# Altium schematic sheet auxpreamp_riaa.SchDoc
size A4; SheetNumber: 1; SheetTotal: 1
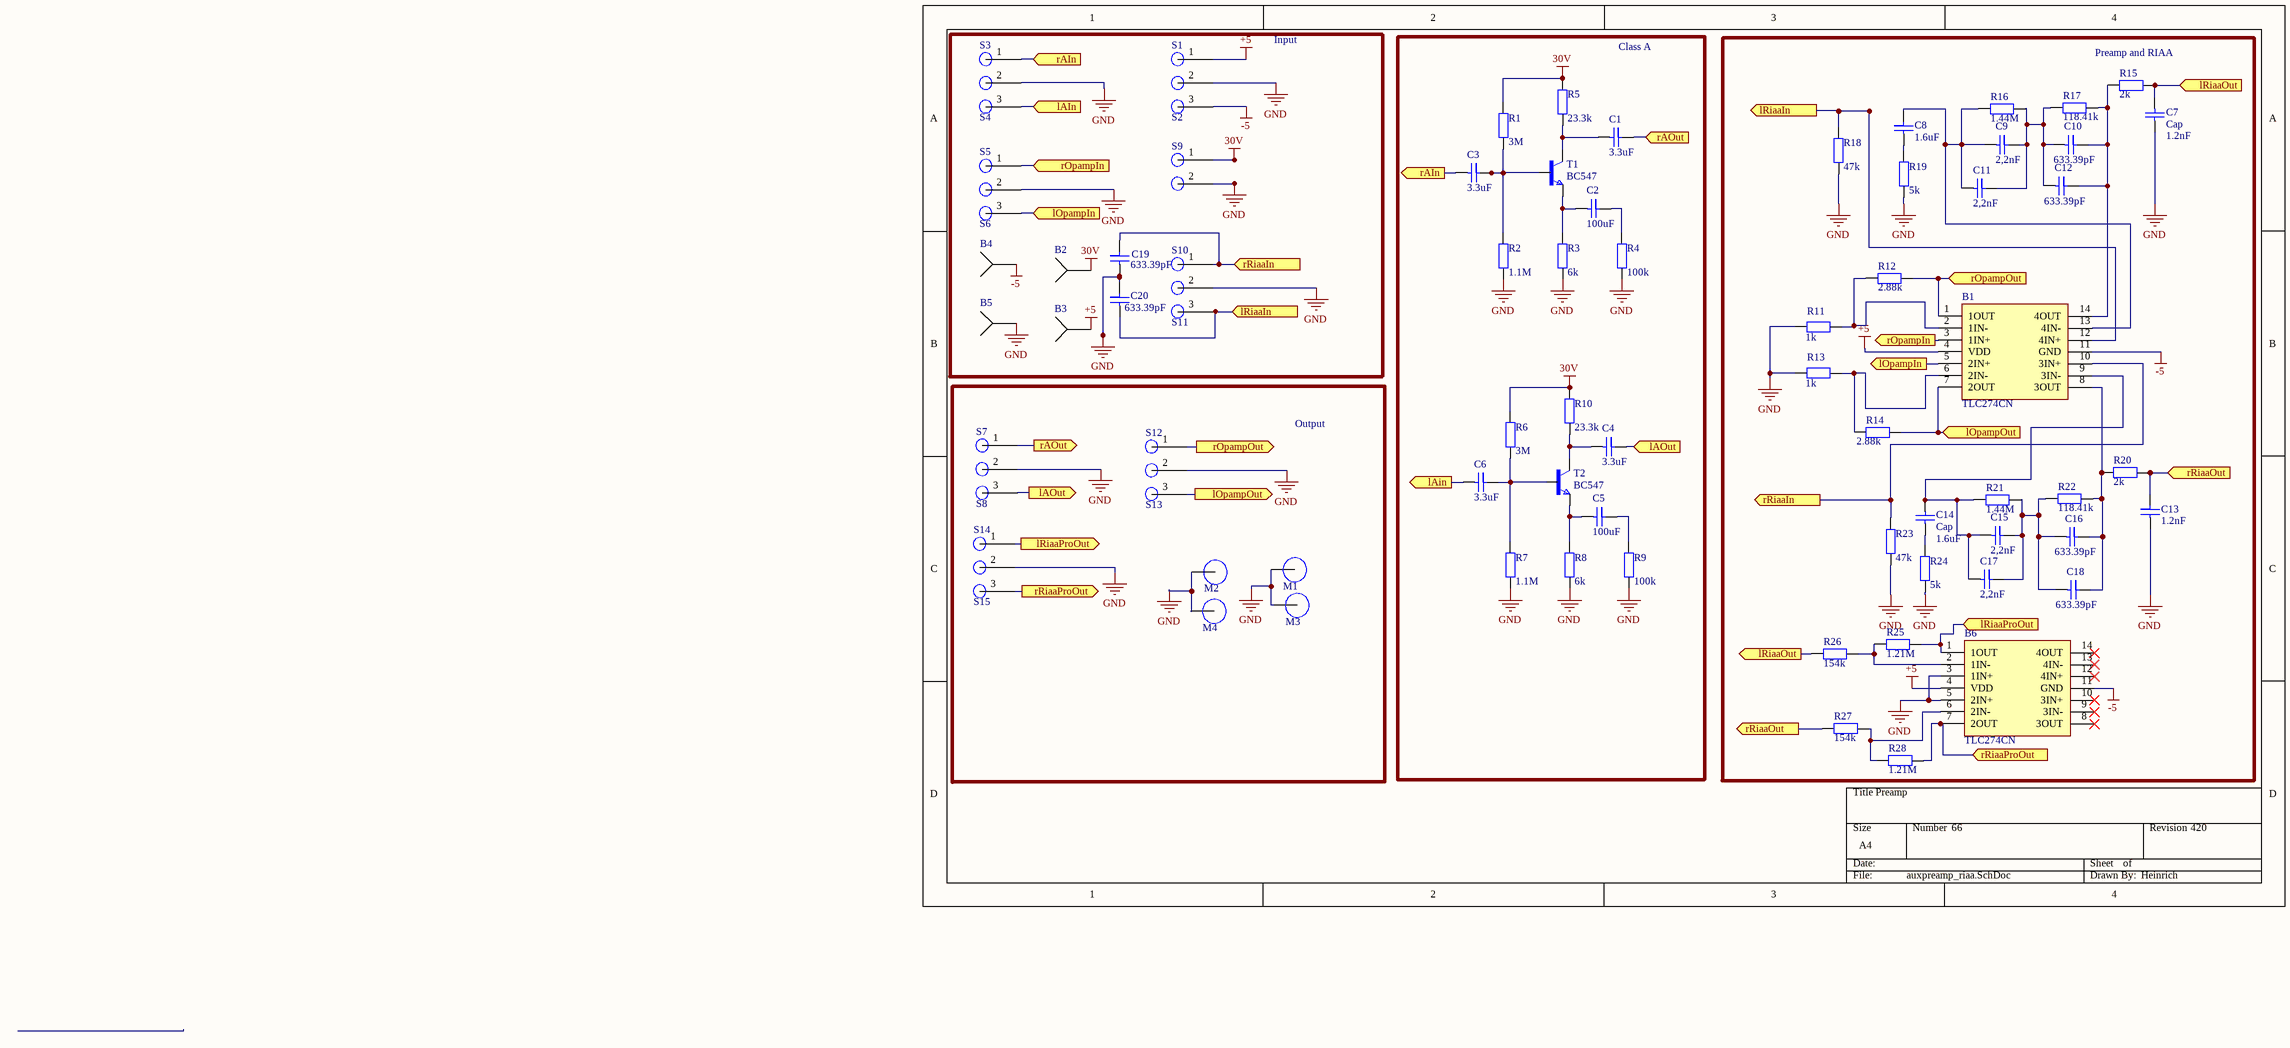
[diagram p0: auxpreamp_riaa.SchDoc]

## Parts
B1  TLC274CN  [DIP794W53P254L1930H508Q14N]
B2  Banana Plug  [Banana Plug On top]  (value not drawn)
B3  Banana Plug  [Banana Plug On top]  (value not drawn)
B4  Banana Plug  [Banana Plug On top]  (value not drawn)
B5  Banana Plug  [Banana Plug On top]  (value not drawn)
B6  TLC274CN  [DIP794W53P254L1930H508Q14N]
C1  Capacity: 3.3uF  [Cap 20mm]  (hidden comment: Cap)
C2  Capacity: 100uF  [Cap Ø8]  (hidden comment: Cap)
C3  Capacity: 3.3uF  [Cap 20mm]  (hidden comment: Cap)
C4  Capacity: 3.3uF  [Cap 20mm]  (hidden comment: Cap)
C5  Capacity: 100uF  [Cap Ø8]  (hidden comment: Cap)
C6  Capacity: 3.3uF  [Cap 20mm]  (hidden comment: Cap)
C7  Cap  value 1.2nF  [RAD-0.3  PCBK]
C8  Capacity: 1.6uF  [Cap-1]  (hidden comment: Cap)
C9  Capacity: 2,2nF  [Cap-1]  (hidden comment: Cap)
C10  Capacity: 633.39pF  [Cap-0]  (hidden comment: Cap)
C11  Capacity: 2,2nF  [Cap-1]  (hidden comment: Cap)
C12  Capacity: 633.39pF  [Cap-0]  (hidden comment: Cap)
C13  Capacity: 1.2nF  [Cap-0]  (hidden comment: Cap)
C14  Cap  value 1.6uF  [RAD-0.3  PCBK]
C15  Capacity: 2,2nF  [Cap-1]  (hidden comment: Cap)
C16  Capacity: 633.39pF  [Cap-0]  (hidden comment: Cap)
C17  Capacity: 2,2nF  [Cap-1]  (hidden comment: Cap)
C18  Capacity: 633.39pF  [Cap-0]  (hidden comment: Cap)
C19  Capacity: 633.39pF  [Cap-0]  (hidden comment: Cap)
C20  Capacity: 633.39pF  [Cap-0]  (hidden comment: Cap)
M1  Screw Hole  [M3 Hole]  (value not drawn)
M2  Screw Hole  [M3 Hole]  (value not drawn)
M3  Screw Hole  [M3 Hole]  (value not drawn)
M4  Screw Hole  [M3 Hole]  (value not drawn)
R1  value 3M  [AXIAL-0.4 PCBK]  (hidden comment: R1)
R2  value 1.1M  [AXIAL-0.4 PCBK]  (hidden comment: R2)
R3  value 6k  [AXIAL-0.4 PCBK]  (hidden comment: R3)
R4  value 100k  [AXIAL-0.4 PCBK]  (hidden comment: R4)
R5  value 23.3k  [AXIAL-0.4 PCBK]  (hidden comment: R5)
R6  value 3M  [AXIAL-0.4 PCBK]  (hidden comment: R6)
R7  value 1.1M  [AXIAL-0.4 PCBK]
R8  value 6k  [AXIAL-0.4 PCBK]  (hidden comment: R8)
R9  value 100k  [AXIAL-0.4 PCBK]
R10  value 23.3k  [AXIAL-0.4 PCBK]  (hidden comment: R10)
R11  value 1k  [AXIAL-0.4 PCBK]  (hidden comment: R6)
R12  value 2.88k  [AXIAL-0.4 PCBK]  (hidden comment: R6)
R13  value 1k  [AXIAL-0.4 PCBK]  (hidden comment: R6)
R14  value 2.88k  [AXIAL-0.4 PCBK]  (hidden comment: R6)
R15  value 2k  [AXIAL-0.4 PCBK]  (hidden comment: R4)
R16  value 1.44M  [AXIAL-0.4 PCBK]  (hidden comment: R4)
R17  value 118.41k  [AXIAL-0.4 PCBK]  (hidden comment: R4)
R18  value 47k  [AXIAL-0.4 PCBK]  (hidden comment: R4)
R19  value 5k  [AXIAL-0.4 PCBK]  (hidden comment: R4)
R20  value 2k  [AXIAL-0.4 PCBK]  (hidden comment: R4)
R21  value 1.44M  [AXIAL-0.4 PCBK]  (hidden comment: R4)
R22  value 118.41k  [AXIAL-0.4 PCBK]  (hidden comment: R4)
R23  value 47k  [AXIAL-0.4 PCBK]  (hidden comment: R4)
R24  value 5k  [AXIAL-0.4 PCBK]  (hidden comment: R4)
R25  value 1.21M  [AXIAL-0.4 PCBK]  (hidden comment: R4)
R26  value 154k  [AXIAL-0.4 PCBK]  (hidden comment: R4)
R27  value 154k  [AXIAL-0.4 PCBK]  (hidden comment: R4)
R28  value 1.21M  [AXIAL-0.4 PCBK]  (hidden comment: R4)
S1  S2  [Screw-3]
S3  S4  [Screw-3]
S5  S6  [Screw-3]
S7  S8  [Screw-3]
S9  Screw 2  [Screw-2]  (value not drawn)
S10  S11  [Screw-3]
S12  S13  [Screw-3]
S14  S15  [Screw-3]
T1  BC547  [TO92]
T2  BC547  [TO92]

## Blocks framed on the sheet
Input: B2-B5 C19 C20 S1 S3 S5 S9 S10
Class A: C1-C6 R1-R10 T1 T2
Preamp and RIAA: B1 B6 C7-C18 R11-R28
Output: M1-M4 S7 S12 S14

## Ports
lAIn (in, see auxpreamp_riaa[2C]), lAin (out, see auxpreamp_riaa[1A]), lAOut (in, see auxpreamp_riaa[1C]), lAOut (out, see auxpreamp_riaa[3B]), lOpampIn (in, see auxpreamp_riaa[3B]), lOpampIn (out, see auxpreamp_riaa[1A]), lOpampOut (in, see auxpreamp_riaa[1C]), lOpampOut (out, see auxpreamp_riaa[3B]), lRiaaIn (in, see auxpreamp_riaa[3A]), lRiaaIn (out, see auxpreamp_riaa[1B]), lRiaaOut (in, see auxpreamp_riaa[3C]), lRiaaOut (out, see auxpreamp_riaa[4A]), lRiaaProOut (in, see auxpreamp_riaa[1C]), lRiaaProOut (out, see auxpreamp_riaa[4C]), rAIn (in, see auxpreamp_riaa[2A]), rAIn (out, see auxpreamp_riaa[1A]), rAOut (in, see auxpreamp_riaa[1B]), rAOut (out, see auxpreamp_riaa[3A]), rOpampIn (in, see auxpreamp_riaa[3B]), rOpampIn (out, see auxpreamp_riaa[1A]), rOpampOut (in, see auxpreamp_riaa[1B]), rOpampOut (out, see auxpreamp_riaa[4B]), rRiaaIn (in, see auxpreamp_riaa[3C]), rRiaaIn (out, see auxpreamp_riaa[1B]), rRiaaOut (in, see auxpreamp_riaa[3D]), rRiaaOut (out, see auxpreamp_riaa[4C]), rRiaaProOut (in, see auxpreamp_riaa[1C]), rRiaaProOut (out, see auxpreamp_riaa[4D])

## Nets
30V: B2.1 R1.2 R5.2 R6.2 R10.2 S9.1
+5: B1.4(VDD) B3.1 B6.4(VDD) S1.1
-5: B1.11(GND) B4.1 B6.11(GND) S1.3
GND: B5.1 B6.3(1IN+) B6.5(2IN+) C7.1 C13.1 C19.1 C20.2(g) M1.1 M2.1 M3.1 M4.1 R2.1 R3.1 R4.1 R7.1 R8.1 R9.1 R11.2 R13.2 R18.1 R19.1 R23.1 R24.1 S1.2 S3.2 S5.2 S7.2 S9.2 S10.2 S12.2 S14.2
lAIn: C6.1 S3.3 ; port lAIn, port lAin
lAOut: C4.2(g) S7.3 ; port lAOut
lOpampIn: B1.5(2IN+) S5.3 ; port lOpampIn
lOpampOut: B1.7(2OUT) R14.1 S12.3 ; port lOpampOut
lRiaaIn: B1.12(4IN+) C20.1 R18.2 S10.3 ; port lRiaaIn
lRiaaOut: C7.2 R15.1 R26.1 ; port lRiaaOut
lRiaaProOut: B6.1(1OUT) R25.2 S14.1 ; port lRiaaProOut
rAIn: C3.1 S3.1 ; port rAIn
rAOut: C1.2(g) S7.1 ; port rAOut
rOpampIn: B1.3(1IN+) S5.1 ; port rOpampIn
rOpampOut: B1.1(1OUT) R12.1 S12.1 ; port rOpampOut
rRiaaIn: B1.10(3IN+) C19.2(g) R23.2 S10.1 ; port rRiaaIn
rRiaaOut: C13.2(g) R20.1 R27.1 ; port rRiaaOut
rRiaaProOut: B6.7(2OUT) R28.2 S14.3 ; port rRiaaProOut
NetB1_2: B1.2(1IN-) R11.1 R12.2
NetB1_6: B1.6(2IN-) R13.1 R14.2
NetB1_8: B1.8(3OUT) C16.2(g) C18.2(g) R20.2 R22.1
NetB1_9: B1.9(3IN-) C14.2 C15.1 C17.1 R21.2
NetB1_13: B1.13(4IN-) C8.2(g) C9.1 C11.1 R16.2
NetB1_14: B1.14(4OUT) C10.2(g) C12.2(g) R15.2 R17.1
NetB6_2: B6.2(1IN-) R25.1 R26.2
NetB6_6: B6.6(2IN-) R27.2 R28.1
NetC1_1: C1.1 R5.1 T1.1(C)
NetC2_1: C2.1 R3.2 T1.3(E)
NetC2_2: C2.2(g) R4.2
NetC3_2: C3.2(g) R1.1 R2.2 T1.2(B)
NetC4_1: C4.1 R10.1 T2.1(C)
NetC5_1: C5.1 R8.2 T2.3(E)
NetC5_2: C5.2(g) R9.2
NetC6_2: C6.2(g) R6.1 R7.2 T2.2(B)
NetC8_1: C8.1 R19.2
NetC9_2: C9.2(g) C10.1 C11.2(g) C12.1 R16.1 R17.2
NetC14_1: C14.1 R24.2
NetC15_2: C15.2(g) C16.1 C17.2(g) C18.1 R21.1 R22.2

Not connected (* = marked no-connect by the designer): B6 8(3OUT)* 9(3IN-)* 10(3IN+)* 12(4IN+)* 13(4IN-)* 14(4OUT)*

## Notes on the sheet
- (near R28) Preamp
- 66
- 420
- Heinrich

## Library data of the parts
B1 B6 = TLC274CN: Quad Single Supply Operational Amplifier; Manufacturer_Name: Texas Instruments; Geometry.Height: 5.08mm; Mouser Part Number: 595-TLC274CN; Mouser Price/Stock: https://www.mouser.co.uk/ProductDetail/Texas-Instruments/TLC274CN?qs=Zu35EjizYSRqAk%2FahP1cKg%3D%3D; Manufacturer_Part_Number: TLC274CN; Datasheet Link: http://www.ti.com/lit/gpn/tlc274
C1 C3 C4 C6 = Capacitor big ceramic
C2 C5 = Capacitor unpolarized
C7 C14 = Cap PCBK: Capacitor; Published: 8-Jun-2000; LatestRevisionDate: 17-Jul-2002; LatestRevisionNote: Re-released for DXP Platform.; PackageReference: RAD-0.3; Publisher: Altium Limited
C8 C9 C11 C15 C17 = Capacitor 1 space
C10 C12 C13 C16 C18-C20 = Capacitor 0 space
R1-R28 = Res PCBK: Resistor; Published: 8-Jun-2000; LatestRevisionDate: 17-Jul-2002; LatestRevisionNote: Re-released for DXP Platform.; PackageReference: AXIAL-0.4; Publisher: Altium Limited
S1 S3 S5 S7 S10 S12 S14 = Screw 3
T1 T2 = BC547: Trans GP BJT NPN 45V 0.1A 500mW 3-Pin TO-92 T/R; MF: ON Semiconductor; SnapEDA_Link: https://www.snapeda.com/parts/BC547/Onsemi/view-part/?ref=snap; Package: None; Value: *; MP: BC547; Check_prices: https://www.snapeda.com/parts/BC547/Onsemi/view-part/?ref=eda